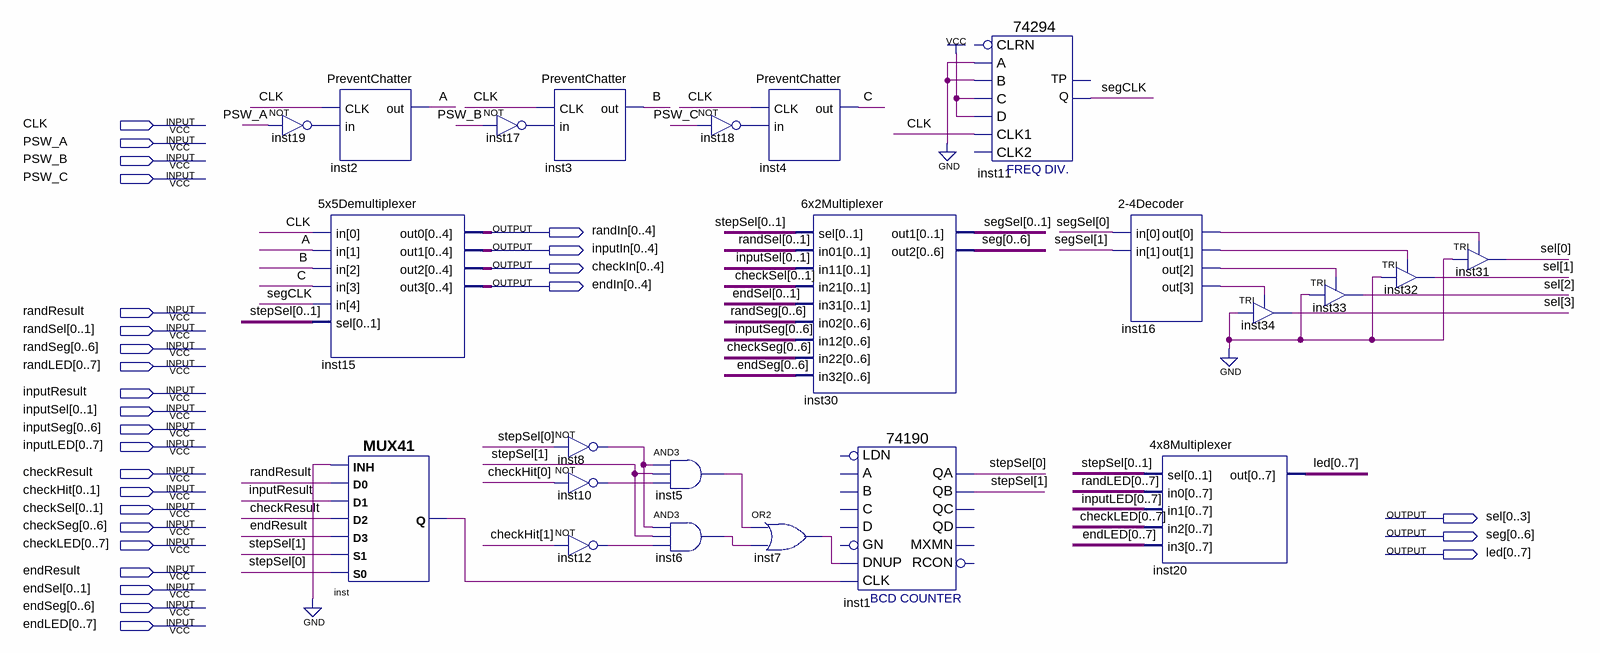
[diagram p0: schematic sheet]
// Quartus schematic GameManager.bdf as structural Verilog: 23 symbols, 28 pins
module GameManager (
  input  CLK,
  input  PSW_A,
  input  PSW_B,
  input  PSW_C,
  input  randResult,
  input  [0:1] randSel,
  input  [0:6] randSeg,
  input  [0:7] randLED,
  input  inputResult,
  input  [0:1] inputSel,
  input  [0:6] inputSeg,
  input  [0:7] inputLED,
  input  checkResult,
  input  [0:1] checkHit,
  input  [0:1] checkSel,
  input  [0:6] checkSeg,
  input  [0:7] checkLED,
  input  endResult,
  input  [0:1] endSel,
  input  [0:6] endSeg,
  input  [0:7] endLED,
  output [0:4] randIn,
  output [0:4] inputIn,
  output [0:4] checkIn,
  output [0:4] endIn,
  output [0:3] sel,
  output [0:6] seg,
  output [0:7] led
);

  wire A, B, C, inst5_out, inst6_out, inst7_out, inst8_out, inst10_out, inst12_out, inst16_out, inst16_out_2,
       inst16_out_3, inst16_out_4, inst17_out, inst18_out, inst19_out, inst_q, segCLK;
  wire [1:0] segSel, stepSel;

  PreventChatter inst2 (.CLK(CLK), .in(inst19_out), .out(A));
  not inst19 (inst19_out, PSW_A);
  \5x5Demultiplexer  inst15 (
    .in({segCLK, C, B, A, CLK}), .sel({stepSel[0], stepSel[1]}), .out0(randIn), .out1(inputIn),
    .out2(checkIn), .out3(endIn));
  MUX41 inst (
    .S0(stepSel[0]), .D2(checkResult), .S1(stepSel[1]), .D3(endResult), .D0(randResult), .INH(1'b0),
    .D1(inputResult), .Q(inst_q));
  PreventChatter inst3 (.CLK(CLK), .in(inst17_out), .out(B));
  not inst17 (inst17_out, PSW_B);
  not inst8 (inst8_out, stepSel[0]);
  not inst10 (inst10_out, checkHit[0]);
  not inst12 (inst12_out, checkHit[1]);
  and inst5 (inst5_out, inst8_out, stepSel[1], inst10_out);
  and inst6 (inst6_out, inst8_out, stepSel[1], inst12_out);
  PreventChatter inst4 (.CLK(CLK), .in(inst18_out), .out(C));
  not inst18 (inst18_out, PSW_C);
  or inst7 (inst7_out, inst5_out, inst6_out);
  \6x2Multiplexer  inst30 (
    .sel({stepSel[0], stepSel[1]}), .in01(randSel), .in11(inputSel), .in21(checkSel), .in31(endSel),
    .in02(randSeg), .in12(inputSeg), .in22(checkSeg), .in32(endSeg), .out1({segSel[0], segSel[1]}), .out2(seg));
  \74190  inst1 (
    .CLK(inst_q), .DNUP(inst7_out), .QA(stepSel[0]), .QB(stepSel[1]));  // open: LDN, A, C, B, D, GN, QD, QC, MXMN, RCON
  \74294  inst11 (.A(1'b0), .B(1'b0), .C(1'b1), .CLK1(CLK), .D(1'b1), .Q(segCLK));  // open: CLK2, CLRN, TP
  \2-4Decoder  inst16 (.in(segSel), .out({inst16_out_4, inst16_out_3, inst16_out_2, inst16_out}));
  \4x8Multiplexer  inst20 (
    .sel({stepSel[0], stepSel[1]}), .in0(randLED), .in1(inputLED), .in2(checkLED), .in3(endLED), .out(led));
  TRI inst34 (.IN(1'b0), .OE(inst16_out_4), .OUT(sel[3]));
  TRI inst33 (.IN(1'b0), .OE(inst16_out_3), .OUT(sel[2]));
  TRI inst32 (.IN(1'b0), .OE(inst16_out_2), .OUT(sel[1]));
  TRI inst31 (.IN(1'b0), .OE(inst16_out), .OUT(sel[0]));
endmodule
